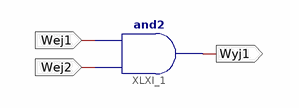
[diagram p0: schematic sheet 1]
// Xilinx ISE schematic schematic_zad1.sch (xc9500xl) as structural Verilog: 1 symbols, 3 ports
module schematic_zad1 (
  input  Wej1,
  input  Wej2,
  output Wyj1
);

  and XLXI_1 (Wyj1, Wej2, Wej1);
endmodule
